# EAGLE design SaLEasyMag (EAGLE 7.2.0)
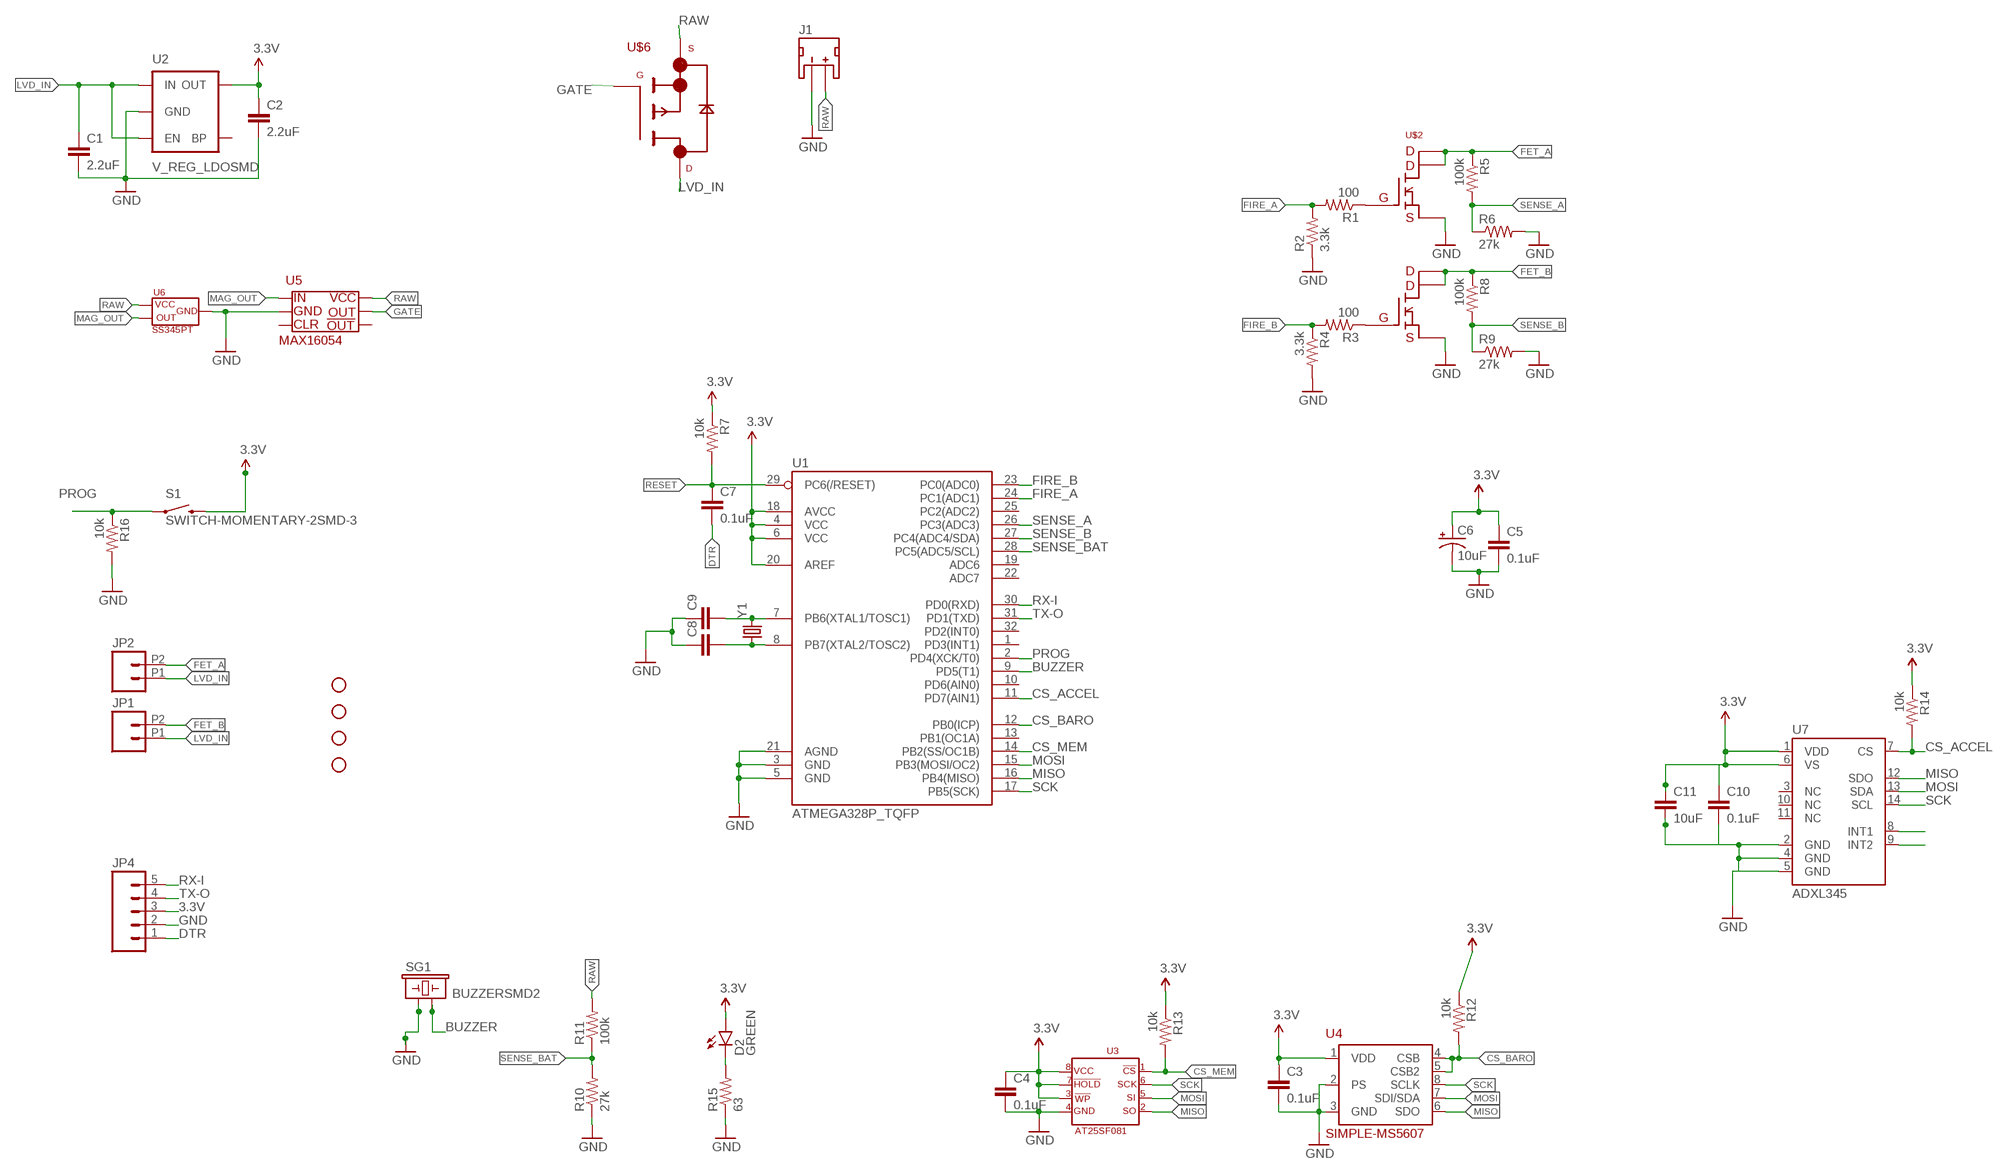
[diagram p0: schematic, sheet 1]

## Parts
C1  2.2uF  CAP0603-CAP  [0603-CAP]
C2  2.2uF  CAP0603-CAP  [0603-CAP]
C3  0.1uF  CAP0603-CAP  [0603-CAP]
C4  0.1uF  CAP0603-CAP  [0603-CAP]
C5  0.1uF  CAP0603-CAP  [0603-CAP]
C6  10uF  CAP_POL1206  [EIA3216]
C7  0.1uF  CAP0603-CAP  [0603-CAP]
C8  CAP0402-CAP  [0402-CAP]
C9  CAP0402-CAP  [0402-CAP]
C10  0.1uF  CAP0603-CAP  [0603-CAP]
C11  10uF  CAP0603-CAP  [0603-CAP]
D2  GREEN  LED-GREENLARGE  [LED-1206]
J1  JST_2MM_MALE  [JST-2-SMD]
JP1  M022.54MM_SCREWTERM  [1X02_2.54_SCREWTERM]
JP2  M022.54MM_SCREWTERM  [1X02_2.54_SCREWTERM]
JP4  M05SMD  [1X05-1MM]
R1  100  RESISTOR0603-RES  [0603-RES]
R2  3.3k  RESISTOR0603-RES  [0603-RES]
R3  100  RESISTOR0603-RES  [0603-RES]
R4  3.3k  RESISTOR0603-RES  [0603-RES]
R5  100k  RESISTOR0603-RES  [0603-RES]
R6  27k  RESISTOR0603-RES  [0603-RES]
R7  10k  RESISTOR0603-RES  [0603-RES]
R8  100k  RESISTOR0603-RES  [0603-RES]
R9  27k  RESISTOR0603-RES  [0603-RES]
R10  27k  RESISTOR0603-RES  [0603-RES]
R11  100k  RESISTOR0603-RES  [0603-RES]
R12  10k  RESISTOR0603-RES  [0603-RES]
R13  10k  RESISTOR0603-RES  [0603-RES]
R14  10k  RESISTOR0603-RES  [0603-RES]
R15  63  RESISTOR0603-RES  [0603-RES]
R16  10k  RESISTOR0603-RES  [0603-RES]
S1  SWITCH-MOMENTARY-2SMD-3  [TACTILE_SWITCH_SMD-3]
SG1  BUZZERSMD2  [BUZZER-CCV]
STANDOFF1  STAND-OFF  [STAND-OFF]
STANDOFF2  STAND-OFF  [STAND-OFF]
STANDOFF3  STAND-OFF  [STAND-OFF]
STANDOFF4  STAND-OFF  [STAND-OFF]
U1  ATMEGA328P_TQFP  [TQFP32-08]
U2  V_REG_LDOSMD  [SOT23-5]
U3  AT25SF081  [AT25SF081]
U4  SIMPLE-MS5607  [MS5607]
U5  MAX16054  [MAX16054]
U6  SS345PT  [SS345PT]
U7  ADXL345  [LGA14]
U$2  SI7232DN  [SI7232DN]
U$6  SI7615ADN  [SI7615ADN]
Y1  CRYSTAL5X3  [CRYSTAL-SMD-5X3]

## Nets
3.3V: C2.1 C3.1 C4.1 C5.1 C6.A(+) C10.1 C11.1 D2.A JP4.3 R7.1 R12.1 R13.1 R14.1 S1.4 U1.4(VCC) U1.6(VCC) U1.18(AVCC) U1.20(AREF) U2.5(OUT) U3.!HOLD U3.!WP U3.VCC U4.1(VDD) U7.1(VDD) U7.6(VS)
BUZZER: SG1.- U1.9(PD5(T1))
CS_ACCEL: R14.2 U1.11(PD7(AIN1)) U7.7(CS)
CS_BARO: R12.2 U1.12(PB0(ICP)) U4.4(CSB) U4.5(CSB2)
CS_MEM: R13.2 U1.14(PB2(SS/OC1B)) U3.!CS
DTR: C7.2 JP4.1
FET_A: JP2.P2 R5.1 U$2.7(PIN7) U$2.8(PIN8)
FET_B: JP1.P2 R8.1 U$2.5(PIN5) U$2.6(PIN6)
FIRE_A: R1.2 R2.2 U1.24(PC1(ADC1))
FIRE_B: R3.2 R4.1 U1.23(PC0(ADC0))
GATE: U5.OUT U$6.G
GND: C1.2 C2.2 C3.2 C4.2 C5.2 C6.C(-) C8.1 C9.1 C10.2 C11.2 J1.1(-) JP4.2 R2.1 R4.2 R6.2 R9.2 R10.1 R15.1 R16.2 SG1.+ U1.3(GND) U1.5(GND) U1.21(AGND) U2.2(GND) U3.GND U4.2(PS) U4.3(GND) U5.GND U6.GND U7.2(GND) U7.4(GND) U7.5(GND) U$2.1(PIN1) U$2.3(PIN3)
LVD_IN: C1.1 JP1.P1 JP2.P1 U2.1(IN) U2.3(EN) U$6.D1(D) U$6.D2(D) U$6.D3(D) U$6.D4(D)
MAG_OUT: U5.IN U6.OUT
MISO: U1.16(PB4(MISO)) U3.SO U4.6(SDO) U7.12(SDO)
MOSI: U1.15(PB3(MOSI/OC2)) U3.SI U4.7(SDI/SDA) U7.13(SDA)
N$1: D2.C R15.2
N$2: R3.1 U$2.4(PIN4)
N$3: C9.2 U1.7(PB6(XTAL1/TOSC1)) Y1.3
N$5: C8.2 U1.8(PB7(XTAL2/TOSC2)) Y1.1
N$8: R1.1 U$2.2(PIN2)
N$9: U7.8(INT1)
N$10: U7.9(INT2)
PROG: R16.1 S1.1 U1.2(PD4(XCK/T0))
RAW: J1.2(+) R11.2 U5.VCC U6.VCC U$6.S1(S) U$6.S2(S) U$6.S3(S)
RESET: C7.1 R7.2 U1.29(PC6(/RESET))
RX-I: JP4.5 U1.30(PD0(RXD))
SCK: U1.17(PB5(SCK)) U3.SCK U4.8(SCLK) U7.14(SCL)
SENSE_A: R5.2 R6.1 U1.26(PC3(ADC3))
SENSE_B: R8.2 R9.1 U1.27(PC4(ADC4/SDA))
SENSE_BAT: R10.2 R11.1 U1.28(PC5(ADC5/SCL))
TX-O: JP4.4 U1.31(PD1(TXD))
Unconnected: J1.NC1(PAD1) J1.NC2(PAD2) U1.1(PD3(INT1)) U1.10(PD6(AIN0)) U1.13(PB1(OC1A)) U1.19(ADC6) U1.22(ADC7) U1.25(PC2(ADC2)) U1.32(PD2(INT0)) U2.4(BP) U5.!OUT U5.CLR U7.3(NC) U7.10(NC) U7.11(NC)

## Library data of the parts
C1-C5 C7 C10 C11 = SparkFun-Passives:CAP: Capacitor Standard 0603 ceramic capacitor, and 0.1" leaded capacitor.
C6 = SparkFun-Passives:CAP_POL: Capacitor Polarized These are standard SMD and PTH capacitors. Normally 10uF, 47uF, and 100uF in electrolytic and tantalum varieties. Always verify the external diameter of the through hole cap, it varies with capacity, voltage, and manufacturer. The EIA devices should be standard.
C8 C9 = SparkFun-Capacitors:CAP: Capacitor Standard 0603 ceramic capacitor, and 0.1" leaded capacitor.
D2 = SparkFun-LED:LED-GREEN: Various green LEDs Green LEDs used in SFE Production 0603- DIO-00821 LARGE- DIO-00862 LILYPAD- DIO-09910; PROD_ID: DIO-00862
J1 = SparkFun-Connectors:JST_2MM_MALE: Mates to single-cell LiPo batteries. CONN-11443 Now with smashable polarity marks!; BTM_NEG: -; BTM_POS: +; PROD_ID: CONN-11443; TOP_NEG: -; TOP_POS: +
JP1 JP2 = SparkFun-Connectors:M02: Standard 2-pin 0.1" header. Use with - straight break away headers ( PRT-00116) - right angle break away headers (PRT-00553) - swiss pins (PRT-00743) - machine pins (PRT-00117) - female headers (PRT-00115) Molex polarized connector foot print use with: PRT-08233 with associated crimp pins and housings. 2.54_SCREWTERM for use with PRT-10571. 3.5mm Screw Terminal footprints for PRT-08084 5mm Screw Terminal footprints for use with PRT-08432
JP4 = SparkFun-Connectors:M05: Header 5 Standard 5-pin 0.1" header. Use with straight break away headers (SKU : PRT-00116), right angle break away headers (PRT-00553), swiss pins (PRT-00743), machine pins (PRT-00117), and female headers (PRT-00115). Molex polarized connector foot print use with SKU : PRT-08230 with associated crimp pins and housings.
R1-R16 = SparkFun-Passives:RESISTOR: Resistor Basic schematic elements and footprints for 0603, 1206, and PTH resistors.
S1 = SparkFun-Electromechanical:SWITCH-MOMENTARY-2: Various NO switches- pushbuttons, reed, etc
SG1 = SparkFun-Electromechanical:BUZZER: Buzzer 12mm Spark Fun Electronics SKU : Comp-Buzzer
STANDOFF1-STANDOFF4 = SparkFun-Electromechanical:STAND-OFF: #4 Stand Off This is the mechanical footprint for a #4 phillips button head screw. Use the keepout ring to avoid running the screw head into surrounding components. SKU : PRT-00447
U1 = SparkFun-DigitalIC:ATMEGA328P_TQFP; PROD_ID: IC-09069
U2 = SparkFun-PowerIC:V_REG_LDO: Voltage Regulator LDO Standard 150mA LDO voltage regulator in SOT-23 layout. Micrel part MIC5205. BP (by-pass) pin is used to lower output noise with 470pF cap.
U3 = SaL-lib:AT25SF081: AT25SF081 - 8M memory smd
U4 = MS5607:SIMPLE
U5 = SaL-lib:MAX16054
U6 = SaL-lib:SS345PT
U7 = SparkFun-Sensors:ADXL345: 3-axis SPI/I2C 2/4/8/16g accelerometer
U$2 = SaL-lib:SI7232DN: SI7232DN dual
U$6 = SaL-lib:SI7615ADN
Y1 = SparkFun-FreqCtrl:CRYSTAL: Various standard crystals. Proven footprints.; PROD_ID: XTAL-08218

## Board
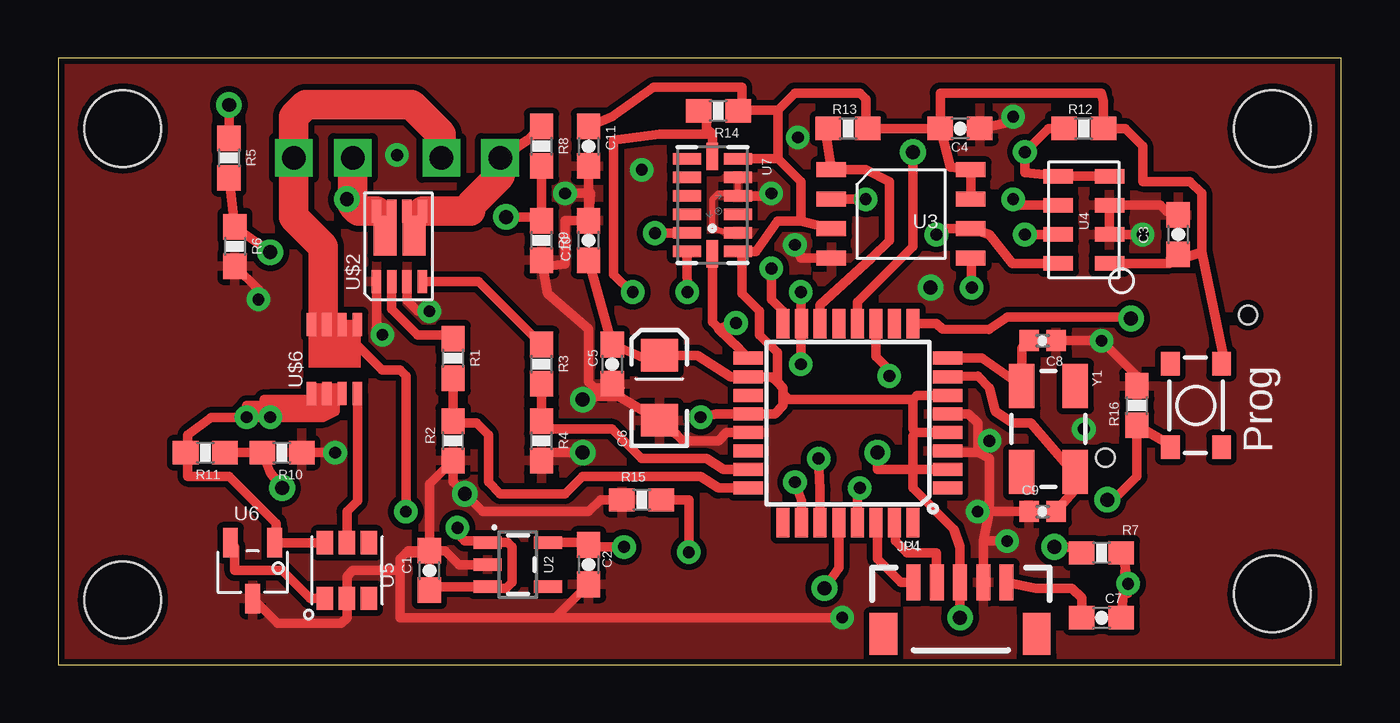
[diagram p1: board, top side]
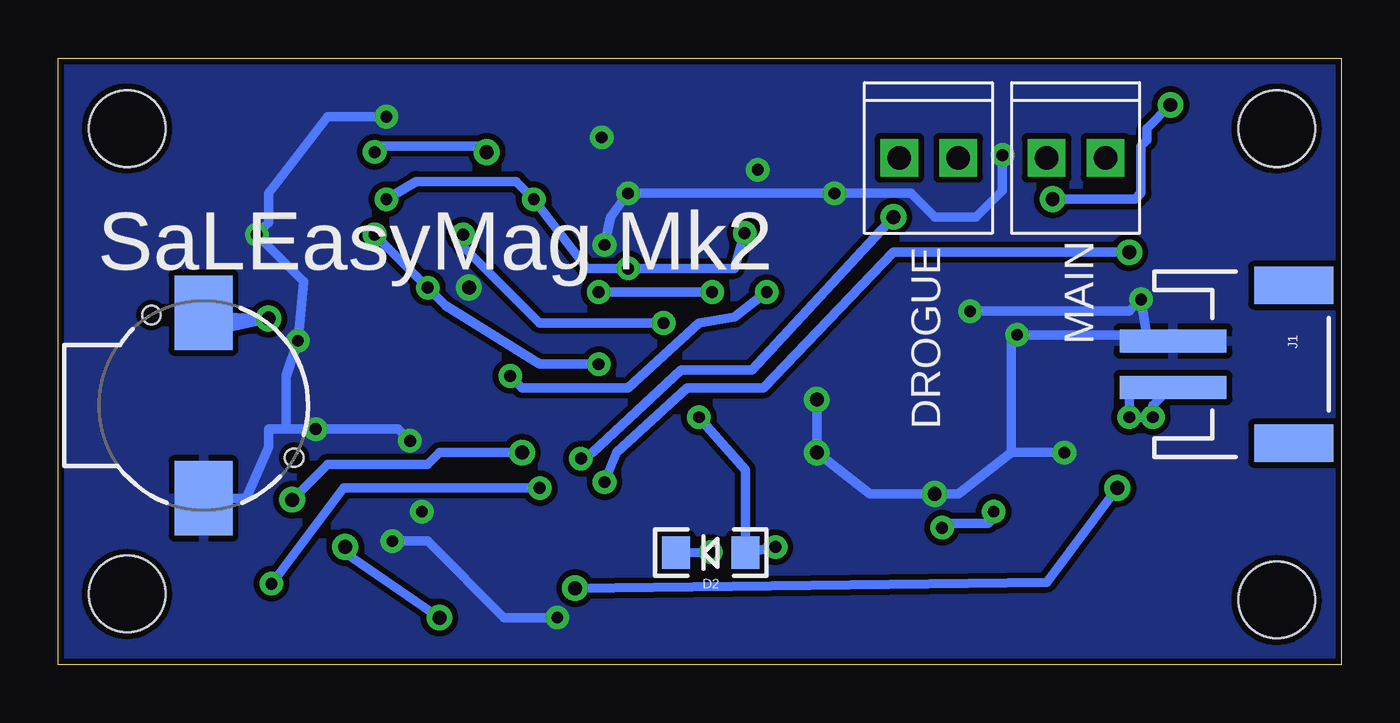
[diagram p2: board, bottom side, seen from below]

Size 55.3 x 26.15 mm. Coordinates in mm from the lower left corner, seen from the top.
Outline: 0,0 55.3,0 55.3,26.15 0,26.15 0,0
Copper layers (1*16): Top 0.035mm / dielectric 1.5mm / Bottom 0.035mm
Design rules "SparkFun *": minimum track width 8mil, minimum drill 20mil, track to track 10mil, track to pad 10mil, pad to pad 10mil, via to via 10mil, smd to smd 10mil, copper to edge 10mil, drill to drill 8mil, minimum pad ring 12mil, minimum via ring 10mil, stop-mask expansion 0mil, vias tented up to drill 25mil, thermal gap 10mil

### Footprints (pad centres in the part's own frame; a part is rotated, then mirrored left to right if it is on the bottom)
0603-CAP = smd 1.1 x 1: 1 -0.85,0; 2 0.85,0
EIA3216 = smd 1.4 x 1.6: A 1.4,0; C -1.4,0
0402-CAP = smd 0.85 x 0.9: 1 -0.58,0; 2 0.58,0
LED-1206 = smd 1.2 x 1.4: A -1.5,0; C 1.5,0
JST-2-SMD = smd 1 x 4.6: 1 -1,-3.7; 2 1,-3.7 | smd 1.6 x 3.4: NC1 -3.4,1.5; NC2 3.4,1.5
1X02_2.54_SCREWTERM = drill 1.016 square: P1 2.54,0; P2 0,0
1X05-1MM = smd 0.6 x 1.55: 1 -2,0; 2 -1,0; 3 0,0; 4 1,0; 5 2,0 | smd 1.2 x 1.8: NC1 -3.3,2.225; NC2 3.3,2.225
0603-RES = smd 1.1 x 1: 1 -0.85,0; 2 0.85,0
TACTILE_SWITCH_SMD-3 = smd 1 x 0.8: 1 -1.8,1.1; 2 1.8,1.1; 3 -1.8,-1.1; 4 1.8,-1.1
BUZZER-CCV = smd 3.2 x 2.5: + 4,0; - -4,0 | hole 0.8: -3.9,-2.25; 2.25,3.9
STAND-OFF = hole 3.302: 0,0
TQFP32-08 = smd 1.27 x 0.559: 1 -4.293,2.8; 2 -4.293,2; 3 -4.293,1.2; 4 -4.293,0.4; 5 -4.293,-0.4; 6 -4.293,-1.2; 7 -4.293,-2; 8 -4.293,-2.8; 17 4.293,-2.8; 18 4.293,-2; 19 4.293,-1.2; 20 4.293,-0.4; 21 4.293,0.4; 22 4.293,1.2; 23 4.293,2; 24 4.293,2.8 | smd 0.559 x 1.27: 9 -2.8,-4.293; 10 -2,-4.293; 11 -1.2,-4.293; 12 -0.4,-4.293; 13 0.4,-4.293; 14 1.2,-4.293; 15 2,-4.293; 16 2.8,-4.293; 25 2.8,4.293; 26 2,4.293; 27 1.2,4.293; 28 0.4,4.293; 29 -0.4,4.293; 30 -1.2,4.293; 31 -2,4.293; 32 -2.8,4.293
SOT23-5 = smd 0.55 x 1.2: 1 -0.95,-1.3; 2 0,-1.3; 3 0.95,-1.3; 4 0.95,1.3; 5 -0.95,1.3
AT25SF081 = smd 1.27 x 0.635: !CS -3,2.54; !HOLD 3,1.27; !WP -3,0; GND -3,-1.27; SCK 3,0; SI 3,-1.27; SO -3,1.27; VCC 3,2.54
MS5607 = smd 1.27 x 0.635: 1 -1.1,1.875; 2 -1.1,0.625; 3 -1.1,-0.625; 4 -1.1,-1.875; 5 1.1,-1.875; 6 1.1,-0.625; 7 1.1,0.625; 8 1.1,1.875
MAX16054 = smd 1 x 0.7: !OUT 1.2,-0.95; CLR -1.2,-0.95; GND -1.2,0; IN -1.2,0.95; OUT 1.2,0; VCC 1.2,0.95
SS345PT = smd 1.27 x 0.635: GND 1.2,0; OUT -1.2,-0.95; VCC -1.2,0.95
LGA14 = smd 0.5 x 1.2: 1 2,1.1; 2 1.2,1.1; 3 0.4,1.1; 4 -0.4,1.1; 5 -1.2,1.1; 6 -2,1.1; 8 -2,-1.1; 9 -1.2,-1.1; 10 -0.4,-1.1; 11 0.4,-1.1; 12 1.2,-1.1; 13 2,-1.1 | smd 1.2 x 0.5: 7 -2.1,0; 14 2.1,0
SI7232DN = smd 0.991 x 0.406: 1 0,0; 2 0,-0.66; 3 0,-1.321; 4 0,-1.981; 5 3.048,-1.981; 6 3.048,-1.321; 7 3.048,-0.66; 8 3.048,0 | smd 1.727 x 0.991: P$9 1.994,-0.368; P$10 1.994,-1.615
SI7615ADN = smd 0.99 x 0.405: D1 2.985,0; D2 2.985,-0.66; D3 2.985,-1.32; D4 2.985,-1.98; G 0,-1.98; S1 0,0; S2 0,-0.66; S3 0,-1.32
CRYSTAL-SMD-5X3 = smd 1.9 x 1.1: 1 -1.85,-1.15; 2 1.85,-1.15; 3 1.85,1.15; 4 -1.85,1.15

### Placement (x,y rotation side)
C1  16,4.06 90 top
C2  22.86,4.32 270 top
C3  48.26,18.54 90 top
C4  38.86,23.11 0 top
C5  23.88,12.95 270 top
C6  25.91,11.94 90 top
C7  44.96,2.03 180 top
C8  42.42,13.97 180 top
C9  42.42,6.6 0 top
C10  22.86,18.29 90 top
C11  22.86,22.35 270 top
D2  27.18,4.83 180 bottom
J1  3.56,12.95 270 bottom
JP1  19.05,21.84 0 bottom
JP2  12.7,21.84 0 bottom
JP4  38.86,3.56 180 top
R1  17.02,13.21 270 top
R2  17.02,9.65 90 top
R3  20.83,12.95 270 top
R4  20.83,9.65 270 top
R5  7.37,21.84 270 top
R6  7.62,18.03 270 top
R7  44.96,4.83 0 top
R8  20.83,22.35 270 top
R9  20.83,18.29 270 top
R10  9.65,9.14 180 top
R11  6.35,9.14 180 top
R12  44.2,23.11 180 top
R13  34.04,23.11 180 top
R14  28.45,23.88 180 top
R15  25.15,7.11 0 top
R16  46.48,11.18 90 top
S1  49.02,11.18 90 top
SG1  49.02,11.18 270 bottom
STANDOFF1  2.79,23.11 0 top
STANDOFF2  2.79,2.79 0 top
STANDOFF3  52.32,23.11 0 top
STANDOFF4  52.32,3.05 0 top
U1  34.04,10.41 180 top
U2  19.81,4.32 270 top
U3  36.32,18.8 0 top
U4  44.2,19.18 180 top
U5  12.45,4.06 90 top
U6  8.38,4.06 270 top
U7  28.19,19.81 270 top
U$2  13.72,16.51 90 top
U$6  10.92,11.68 90 top
Y1  42.67,10.16 270 top

### Tracks (layer width: path | path; a pad name or v marks a point on that pad's centre or on a via)
3.3V  (via drill 0.51, 0.6)
  Top 0.406: U3.!HOLD U3.VCC 38.44,21.45 C4.1 | U1.6 37.01,11.61 36.83,11.43 | 36.83,11.43 36.83,10.16 36.98,10.01 | 36.98,10.01 U1.4 | 31.24,11.68 31.24,11.18 30.88,10.81 U1.20 28.34,10.81 v27.69,10.67 | 31.24,11.68 31.24,11.94 30.99,12.19 | 30.99,12.19 30.77,12.41 U1.18 28.99,12.41 27.56,13.34 C6.A 25.1,13.3 C5.1 C10.1 | U2.5 22.76,5.27 C2.1 22.95,5.08 v24.38,5.08 | C4.1 R13.1 34.8,23.2 34.8,24.38 34.54,24.64 31.75,24.64 31.02,23.91 | 36.83,11.43 31.5,11.43 31.24,11.68 | U4.1 47.87,17.3 C3.1 47.92,17.53 48.51,17.53 49.28,17.78 | 49.28,17.78 49.28,20.32 48.77,20.83 46.74,20.83 46.74,22.35 45.97,23.11 R12.1 45.05,24.3 44.96,24.64 38.01,24.64 C4.1 | 32,19.11 30.99,19.11 30.07,17.81 U7.1 29.46,17.64 29.46,16 30.23,15.24 30.23,14.22 30.99,13.46 30.99,12.19 | U3.!WP 32,19.11 | 32,19.11 32,20.83 31.02,21.81 | 31.02,21.81 U7.6 | 31.02,23.91 31.02,21.81 | 31.02,23.91 29.33,23.91 R14.1 29.46,24.04 29.46,24.89 25.65,24.89 23.88,23.62 C11.1 | 36.98,10.01 36.83,9.87 36.83,7.62 38.61,5.84 38.86,5.08 JP4.3 v38.86,2.03 | 49.28,17.78 50.29,12.89 S1.4 | v42.93,5.08 43.43,5.08 R7.1
  Bottom 0.406: v24.38,5.08 D2.A 25.68,8.41 v27.69,10.67 | v38.86,2.03 42.93,4.83 v42.93,5.08
BUZZER  (via drill 0.6)
  Top 0.406: U1.9 37.85,14.71 38.1,14.48 40.11,14.45 40.89,14.99 45.91,14.99 v46.23,14.92
  Bottom 0.406: 48.51,14.73 48.26,14.99 v46.23,14.92 48.26,14.48 48.51,14.73 | 48.51,14.73 48.51,14.92 SG1.-
CS_ACCEL  (via drill 0.51)
  Top 0.406: R14.2 27.94,23.53 27.94,23.11 28.19,22.86 | U7.7 28.19,22.86 | 28.19,22.86 25.91,22.86 23.94,22.61 23.94,16.83 24.7,16.07 v24.77,16.07 | v35.81,12.45 35.81,12.7 35.24,13.28 U1.11
  Bottom 0.406: v24.77,16.07 26.16,14.99 27.69,14.73 30.73,11.94 35.31,11.94 v35.81,12.45
CS_BARO  (via drill 0.51, 0.6)
  Top 0.406: U4.4 U4.5 41.66,21.22 v41.66,22.1 42.67,23.11 R12.2 | U1.12 34.44,15.64 36.83,18.03 v36.83,22.1
  Bottom 0.406: v36.83,22.1 36.83,22.35 41.4,22.35 v41.66,22.1
CS_MEM
  Top 0.406: U1.14 32.84,15.5 35.05,17.53 35.81,18.29 35.81,20.83 34.8,21.34 U3.!CS 33.07,23 R13.2
DTR
  Top 0.406: JP4.1 42.13,3.3 43.69,3.3 44.11,2.88 C7.2
FET_A  (via drill 0.6)
  Top 0.406: U$2.7 U$2.8 | JP2.P2 12.7,20.32 v12.45,20.07 | 7.45,22.61 R5.1 v7.37,24.13
  Top 1.27: U$2.8 12.95,19.56 12.7,19.81 JP2.P2
  Bottom 0.406: v12.45,20.07 8.89,20.07 8.64,20.32 8.64,22.35 8.38,22.61 8.38,23.11 v7.37,24.13
FET_B
  Top 0.406: U$2.6 U$2.5 | JP1.P2 20.23,22.61 R8.1
  Top 1.27: U$2.5 17.78,19.56 17.78,19.81 19.05,21.08 JP1.P2
FIRE_A
  Top 0.406: R1.2 R2.2 17.11,10.41 18.03,10.41 18.54,9.91 18.54,7.87 19.05,7.37 21.84,7.37 22.61,8.13 27.69,8.13 28.45,7.61 U1.24
FIRE_B
  Top 0.406: U1.23 28.67,8.41 27.94,8.89 25.15,8.89 23.88,10.16 21.17,10.16 R4.1 R3.2
GATE
  Top 0.406: U$6.G 12.9,7.06 12.45,6.6 U5.OUT
GND  (via drill 0.51, 0.6)
  Top 0.254: U7.2 28.89,18.61 28.19,18.8 28.19,20.07 28.45,20.32 29.19,20.32 U7.4 U7.5
  Top 0.406: U6.GND 9.47,1.78 12.19,1.78 12.45,2.03 U5.GND 12.45,3.81 12.7,4.06 14.73,4.06 | 14.73,4.06 14.73,4.57 14.99,4.83 | 14.99,4.83 15.91,4.83 C1.2 | C1.2 15.07,4.91 14.99,4.83 | 14.73,4.06 14.73,2.03 21.42,2.03 | 21.42,2.03 C2.2 | C1.2 16.68,4.91 17.27,4.32 U2.2 | C1.2 16,7.79 R2.1 17.02,7.87 v17.53,7.37 18.29,6.6 22.86,6.6 23.37,7.11 R15.1 | 24.17,11.55 C6.C 26.67,9.91 26.92,9.65 28.45,9.65 28.81,10.01 U1.21 | 24.17,11.55 C5.2 24.22,11.94 23.11,11.94 22.86,12.19 22.86,14.48 21.08,16 R9.2 21.16,17.18 21.84,17.27 21.84,19.14 C10.2 | R4.2 21.17,9.14 v22.61,9.14 22.86,9.14 22.69,9.06 22.86,9.06 | 24.17,11.55 22.73,11.55 v22.61,11.43 | v8.64,15.75 8.64,16.17 R6.2 | R10.1 v11.94,9.14 | v33.78,2.03 21.42,2.03 | U$2.3 15.04,15.7 15.49,15.24 v16,15.24 | U$2.1 13.72,14.48 v13.97,14.22 | C3.2 47.75,19.56 47.5,19.81 U4.3 U4.2 45.31,18.54 v46.74,18.54 | C4.2 40.89,23.37 v41.15,23.62 | C11.2 C10.2 | C8.1 v44.96,13.97 46.48,12.45 R16.2 | U1.3 38.4,9.14 39.62,9.14 | 39.62,9.14 40.13,8.89 40.13,6.6 | 40.13,6.6 C9.1 | U1.5 39.22,10.81 39.62,10.41 39.62,9.65 | 39.62,9.65 39.62,9.14 | v39.62,6.6 40.13,6.6 | v40.13,9.65 39.62,9.65 | U3.GND 32,17.53 v31.75,18.1 | v30.73,20.32 30.61,20.19 29.31,20.19 U7.4 | C10.2 22.95,20.32 v21.84,20.32 | 40.13,6.6 39.86,5.35 JP4.2 | v40.89,5.33 39.88,5.33
  Bottom 0.406: v22.61,11.43 v22.61,9.14 20.32,7.37 v17.53,7.37 16.51,7.37 14.22,9.14 | J1.1 8.37,13.95 | 8.37,13.95 8.38,14.22 v8.64,15.75 9.14,15.24 v16,15.24 | v11.94,9.14 14.22,9.14 | 14.22,9.14 14.22,13.97 v13.97,14.22 8.64,14.22 8.37,13.95 | v41.15,23.62 43.69,23.62 46.23,20.32 46.23,19.05 v46.74,18.54 44.7,16.51 v44.96,13.97 45.47,12.45 45.47,10.16 v44.2,10.16 | v44.2,10.16 46.23,10.16 46.23,9.4 47.18,7.18 SG1.+ | v44.2,10.16 40.64,10.16 v40.13,9.65 | v31.75,18.1 31.5,19.3 v30.73,20.32 v21.84,20.32 18.54,20.32 17.53,19.3 15.75,19.3 14.6,20.45 v14.6,21.97 | v33.78,2.03 36.07,2.03 39.37,5.33 v40.89,5.33
  other vias: 37.59,16.26 25.15,21.34 31.88,22.73
  pour Top: -0.76,29.46 69.09,26.42 60.96,-10.67 -16,-6.1
  pour Bottom: -5.59,23.11 -4.83,29.72 -4.83,29.46 58.42,29.46 58.42,-10.67 47.75,-16.76 -8.13,-15.49
LVD_IN  (via drill 0.51)
  Top 0.406: C1.1 16.16,3.37 U2.3 18.58,3.3 19.3,3.3 19.56,3.56 19.56,5.08 19.37,5.27 U2.1 18.45,5.33 17.53,5.33 17.27,5.59 v17.21,5.91 | U$6.D3 12.24,14.43 13.97,12.7 14.73,12.7 14.99,12.45 v14.99,6.6 | U$6.D1 U$6.D2 U$6.D3 | U$6.D3 U$6.D4
  Top 1.27: JP1.P1 16.51,22.86 15.24,24.13 10.67,24.13 10.16,23.62 JP2.P1 10.16,19.3 11.43,18.03 11.43,14.82 | 11.43,14.82 U$6.D2 | 11.43,14.82 11.43,14.73
  Bottom 0.406: v14.99,6.6 14.99,6.35 15.24,6.1 17.02,6.1 v17.21,5.91
MAG_OUT
  Top 0.406: U5.IN 10.85,2.86 9.65,4.06 7.62,4.06 7.62,5.08 U6.OUT
MISO  (via drill 0.51)
  Top 0.406: U4.6 41.41,19.8 v41.15,20.07 | v34.8,20.07 U3.SO | U7.12 26.49,18.61 v25.72,18.61 | U1.16 31.24,15.25 30.73,15.75 v30.73,17.08
  Bottom 0.406: v41.15,20.07 39.88,20.83 35.56,20.83 v34.8,20.07 32.51,17.08 v30.73,17.08 26.16,17.08 v25.72,18.61
MOSI  (via drill 0.51)
  Top 0.406: U7.13 27.09,17.19 v27.11,16.07 | v32,12.95 32,14.68 U1.15 32,14.74 v32,16.07 | U4.7 v41.67,18.55 v41.66,18.54 | U3.SI v39.37,16.26
  Bottom 0.406: v41.66,18.54 v39.37,16.26 38.61,15.49 34.54,12.95 v32,12.95 | v27.11,16.07 v32,16.07
N$1  (via drill 0.51)
  Top 0.406: R15.2 27.18,7.11 v27.18,4.85
  Bottom 0.406: v27.18,4.85 D2.C
N$2
  Top 0.406: U$2.4 18.12,16.51 R3.1
N$3
  Top 0.406: U1.7 39.63,12.45 40.13,11.94 40.39,10.92 41.15,10.41 41.91,10.41 43.51,8.56 Y1.3 43.76,7.49 C9.2
N$5
  Top 0.406: U1.8 39.81,13.21 Y1.1 41.52,13.65 C8.2
N$8
  Top 0.406: U$2.2 14.38,15.34 15.49,14.22 16.85,14.22 R1.1
PROG  (via drill 0.6)
  Top 0.406: U1.2 35.31,8.41 v35.31,9.14 | v45.21,7.11 45.47,7.11 46.48,8.13 R16.1 47.92,9.48 S1.1
  Bottom 0.406: v35.31,9.14 38.86,9.14 39.37,8.64 43.69,8.64 v45.21,7.11
RAW  (via drill 0.51)
  Top 0.406: U5.VCC U6.VCC 9.4,5.33 9.4,6.1 7.37,8.13 5.59,8.13 5.59,9.23 | U$6.S3 11.94,11.68 | 11.94,11.68 U$6.S2 U$6.S1 11.18,11.43 | 11.18,11.43 11.68,11.18 8.13,10.92 8.13,11.18 10.67,11.18 11.43,10.92 9.4,10.92 v9.14,10.67 | v9.14,10.67 v8.13,10.67 6.6,10.67 5.59,9.91 5.59,9.23 | v9.14,10.67 11.43,10.67 11.94,10.92 11.94,11.68 | 11.94,11.68 11.18,11.94 | 11.18,11.94 11.18,11.43 | 11.18,11.43 9.14,11.43 | 8.89,11.43 9.14,11.43 | 9.14,11.43 v9.14,10.67 | 12.19,11.94 11.18,11.94 | 5.59,9.23 R11.2
  Bottom 0.406: 9.14,11.94 v9.14,10.67 v8.13,10.67 8.13,11.18 7.37,11.94 7.27,11.94 J1.2
RESET  (via drill 0.51)
  Top 0.406: R7.2 45.97,4.23 | 45.97,4.23 C7.1 | U1.29 34.44,7.51 v34.54,7.62 | v46.1,3.49 46.1,3.09 45.97,4.23
  Bottom 0.406: v34.54,7.62 42.99,7.62 v46.1,3.49
RX-I
  Top 0.406: U1.30 35.31,6.05 35.31,4.57 36.32,3.56 JP4.5
SCK  (via drill 0.51)
  Top 0.406: U7.14 28.19,14.76 29.35,13.61 | 29.35,13.61 U1.17 | U4.8 41.12,17.3 40.13,18.54 U3.SCK 38.35,18.8 v37.85,18.54 | v29.21,14.73 28.45,14.48 29.35,13.61
  Bottom 0.406: v37.85,18.54 37.85,18.03 34.54,14.73 v29.21,14.73
SENSE_A  (via drill 0.51, 0.6)
  Top 0.406: U1.26 32.04,7.08 v31.75,7.87 | v9.14,17.78 7.71,18.8 R6.1 R5.2
  Bottom 0.406: v31.75,7.87 31.24,9.14 28.19,11.94 24.89,11.94 19.3,17.78 v9.14,17.78
SENSE_B  (via drill 0.51, 0.6)
  Top 0.406: U1.27 32.84,7.55 v32.77,8.89 | v19.3,19.3 20.92,19.3 R9.1 R8.2
  Bottom 0.406: v32.77,8.89 32.26,9.14 28.45,12.7 25.4,12.7 v19.3,19.3
SENSE_BAT  (via drill 0.6)
  Top 0.406: U1.28 33.64,4.17 v33.02,3.3 | v9.65,7.62 9.14,8.29 R10.2 R11.1
  Bottom 0.406: v33.02,3.3 12.7,3.56 v9.65,7.62
TX-O
  Top 0.406: U1.31 36.07,6.09 36.07,5.33 36.58,4.83 37.85,4.83 37.86,3.54 JP4.4

### Text on the board
tNames: Prog
bNames: MAIN | SaLEasyMag Mk2 | DROGUE